# Altium schematic sheet Amplifier_Right.SchDoc
size A4
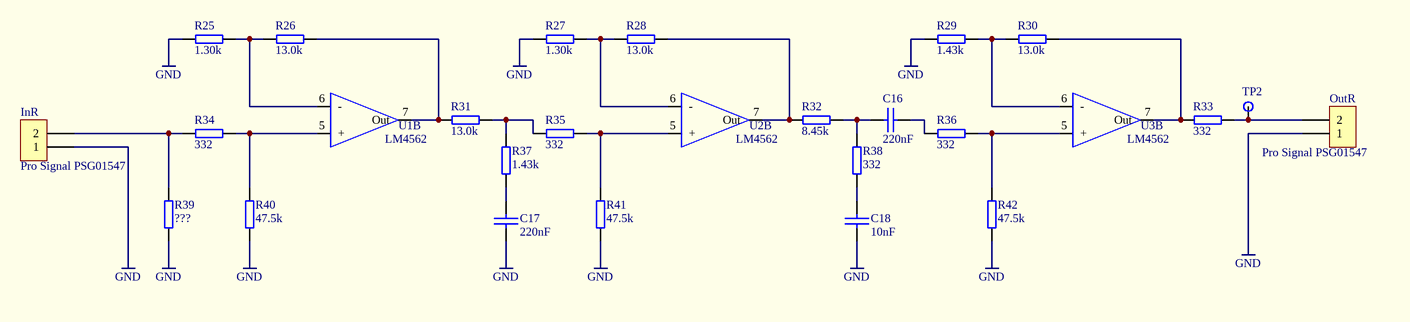
[diagram p0: Amplifier_Right.SchDoc]

## Parts
C16  220nF  [CAP_C200-1]
C17  220nF  [CAP_C200-1]
C18  10nF  [CAP_C200]
InR  Pro Signal PSG01547  [CON_RCA_PSG01547]
OutR  Pro Signal PSG01547  [CON_RCA_PSG01547]
R25  1.30k  [RES_R400]
R26  13.0k  [RES_R400]
R27  1.30k  [RES_R400]
R28  13.0k  [RES_R400]
R29  1.43k  [RES_R400]
R30  13.0k  [RES_R400]
R31  13.0k  [RES_R400]
R32  8.45k  [RES_R400]
R33  332  [RES_R400]
R34  332  [RES_R400]
R35  332  [RES_R400]
R36  332  [RES_R400]
R37  1.43k  [RES_R400]
R38  332  [RES_R400]
R39  ???  [RES_R400]
R40  47.5k  [RES_R400]
R41  47.5k  [RES_R400]
R42  47.5k  [RES_R400]
TP2  TESTPAD  [MISC_PAD-36/65]  (value not drawn)
U1  LM4562  [IC_DIP-8]  (part B of 2)
U2  LM4562  [IC_DIP-8]  (part B of 2)
U3  LM4562  [IC_DIP-8]  (part B of 2)

## Nets
GND: C17.2 C18.2 InR.1 OutR.1 R25.2 R27.2 R29.2 R39.1 R40.2 R41.2 R42.2
NetC16_1: C16.1 R32.1 R38.1
NetC16_2: C16.2 R36.2
NetC17_1: C17.1 R37.2
NetC18_1: C18.1 R38.2
NetInR_2: InR.2 R34.2 R39.2
NetOutR_2: OutR.2 R33.1 TP2.1
NetR25_1: R25.1 R26.2 U1.6(-)
NetR26_1: R26.1 R31.2 U1.7(Out)
NetR27_1: R27.1 R28.2 U2.6(-)
NetR28_1: R28.1 R32.2 U2.7(Out)
NetR29_1: R29.1 R30.2 U3.6(-)
NetR30_1: R30.1 R33.2 U3.7(Out)
NetR31_1: R31.1 R35.2 R37.1
NetR34_1: R34.1 R40.1 U1.5(+)
NetR35_1: R35.1 R41.1 U2.5(+)
NetR36_1: R36.1 R42.1 U3.5(+)

## Library data of the parts
C16-C18 = CAP: Capacitor
InR OutR = CON2: Connector
R25-R42 = RES: Resistor
U1-U3 = OPAMP_Dual: standard dual op-amp